# EAGLE schematic pen15 (EAGLE 5.07)
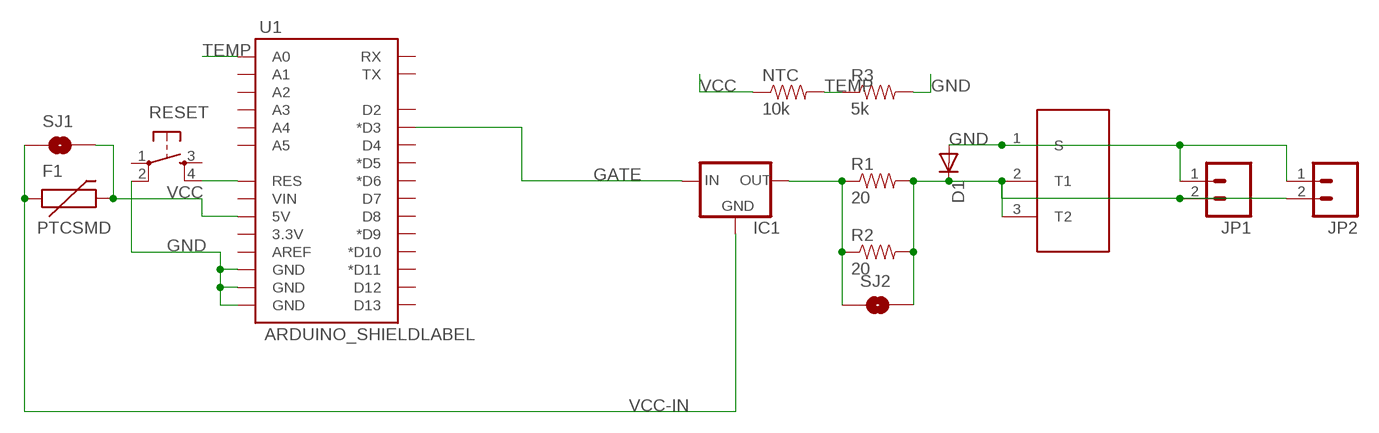
[diagram p0: schematic, sheet 1]

## Parts
D1  DIODESMA  [SMA-DIODE]
F1  PTCSMD  [PTC-1206]
IC1  V_REG_78XXSIDE  [78XXL]
JP1  M02-JST-2MM-SMT  [S2B-PH]
JP2  M023.5MM  [SCREWTERMINAL-3.5MM-2]
NTC  10k  RESISTOR0603-RES  [0603-RES]
R1  20  RESISTOR2512  [R2512]
R2  20  RESISTOR2512  [R2512]
R3  5k  RESISTOR0603-RES  [0603-RES]
RESET  TAC_SWITCHPTH  [TACTILE-PTH]
SJ1  SOLDERJUMPERNO  [SJ_2S-NO]
SJ2  SOLDERJUMPERNO  [SJ_2S-NO]
U1  ARDUINO_SHIELDLABEL  [DUEMILANOVE_SHIELD]
U$1  2.5MM-KOBIKON  [2.5MM-KOBIKON]

## Nets
GATE: IC1.IN U1.D3(*D3)
GND: D1.A JP1.1 JP2.1 R3.2 RESET.2 U1.GND@0(GND) U1.GND@1(GND) U1.GND@2(GND) U$1.1(S)
N$2: D1.C JP1.2 JP2.2 R1.2 R2.2 SJ2.2 U$1.2(T1) U$1.3(T2)
N$5: RESET.4 U1.RES
PWM-MOTOR: IC1.OUT R1.1 R2.1 SJ2.1
TEMP: NTC.2 R3.1 U1.A0
VCC: F1.2 NTC.1 SJ1.2 U1.5V
VCC-IN: F1.1 IC1.GND SJ1.1
Unconnected: RESET.1 RESET.3 U1.3.3V U1.A1 U1.A2 U1.A3 U1.A4 U1.A5 U1.AREF U1.D2 U1.D4 U1.D5(*D5) U1.D6(*D6) U1.D7 U1.D8 U1.D9(*D9) U1.D10(*D10) U1.D11(*D11) U1.D12 U1.D13 U1.RX U1.TX U1.VIN

## Library data of the parts
D1 = SparkFun:DIODE: Diode These are standard reverse protection diodes and small signal diodes. SMA package can handle up to about 1A. SOD-323 can handle about 200mA. What the SOD-323 package when ordering, there are some mfgs out there that are 5-pin packages.
F1 = SparkFun:PTC: Resettable Fuse PTC Resettable Fuse. Spark Fun Electronics SKU : COM-08357
IC1 = SparkFun:V_REG_78XX: Voltage Regulator Standard 7805 5V regulator. IGO (Input Ground Output). Spark Fun Electronics SKU : COM-00107
JP1 JP2 = SparkFun:M02: Header 2 Standard 2-pin 0.1" header. Use with straight break away headers (SKU : PRT-00116), right angle break away headers (PRT-00553), swiss pins (PRT-00743), machine pins (PRT-00117), and female headers (PRT-00115). Molex polarized connector foot print use with SKU : PRT-08233 with associated crimp pins and housings.
NTC R1-R3 = SparkFun:RESISTOR: Resistor Basic schematic elements and footprints for 0603, 1206, and PTH 1/10th watt (small) resistors.
RESET = SparkFun:TAC_SWITCH: Momentary Switch Button commonly used for reset or general input. Spark Fun Electronics SKU : COM-00097
SJ1 SJ2 = SparkFun:SOLDERJUMPER: Solder Jumper Standard SMD solder jumper. Used to automate production. Two varients : Normally Open and Normally Closed are the same, but have different paste layers. NC will have a large amount of paste and should jumper during reflow.
U1 = SparkFun:ARDUINO_SHIELD
U$1 = BLP3:2.5MM-KOBIKON